# Altium schematic sheet 1_P1.schdoc
size 309 x 223 mm; Symbol: Sheet-Symbol_A4; Device: Sheet-Symbol_A4; @Page Name: P1; @Create Date: 2023-04-06; @Page Count: 1; @Page No: 1; @Project Name: smartcar2023(not_use); @Schematic Name: Schematic2; @Update Date: 2023-05-09; Company: 嘉立创EDA; Page Size: A4; Version: V1.0
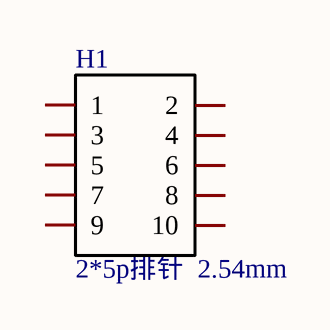
[diagram p0: 1_P1.schdoc]

## Parts
H1  2*5p排针  2.54mm  [HDR-TH_10P-P2.54-V-M-R2-C5-S2.54]

## Nets

Not connected (* = marked no-connect by the designer): H1 1 2 3 4 5 6 7 8 9 10

## Notes on the sheet
- 1
- 2
- 3
- 4
- 5
- 6
- A
- B
- C
- Schematic
- Schematic2
- Create Date
- Update Date
- 2023-04-06
- 2023-05-09
- Reviewed
- Drawed
- Page
- P1
- Part Number
- smartcar2023(not_use)
- D
- VER
- SIZE
- PAGE
- OF
- V1.0
- A4
- 嘉立创EDA

## Library data of the parts
H1 = 2*5p排针  2.54mm: 排针、排座、跳线帽/2.54mm2*40P直排针环保http://www.360yuanjian.com/product/details_2707.html和这个一样，但是是2*5P的; Symbol: Header-Male-2.54_2x5; Add into BOM: yes; Name: 2*5p排针  2.54mm; Device: 2*5p排针  2.54mm; LCSC Part Name: 2.54mm 2*5p 排针; Supplier Part: C28207; Manufacturer Part: 2*5p排针  2.54mm; Supplier Footprint: Through Hole; JLCPCB Part Class: 扩展库; Datasheet: https://atta.szlcsc.com/upload/public/pdf/source/20140331/1457707039232.pdf; Supplier: LCSC; Convert to PCB: yes